# EasyEDA schematic SCH_mini_attiny_2026-08-26.json
TITLE: Sheet_1; REV: 1.0; Date: 2026-08-21; Sheet: 1/1; Drawn By: patriq128; Company: Your Company
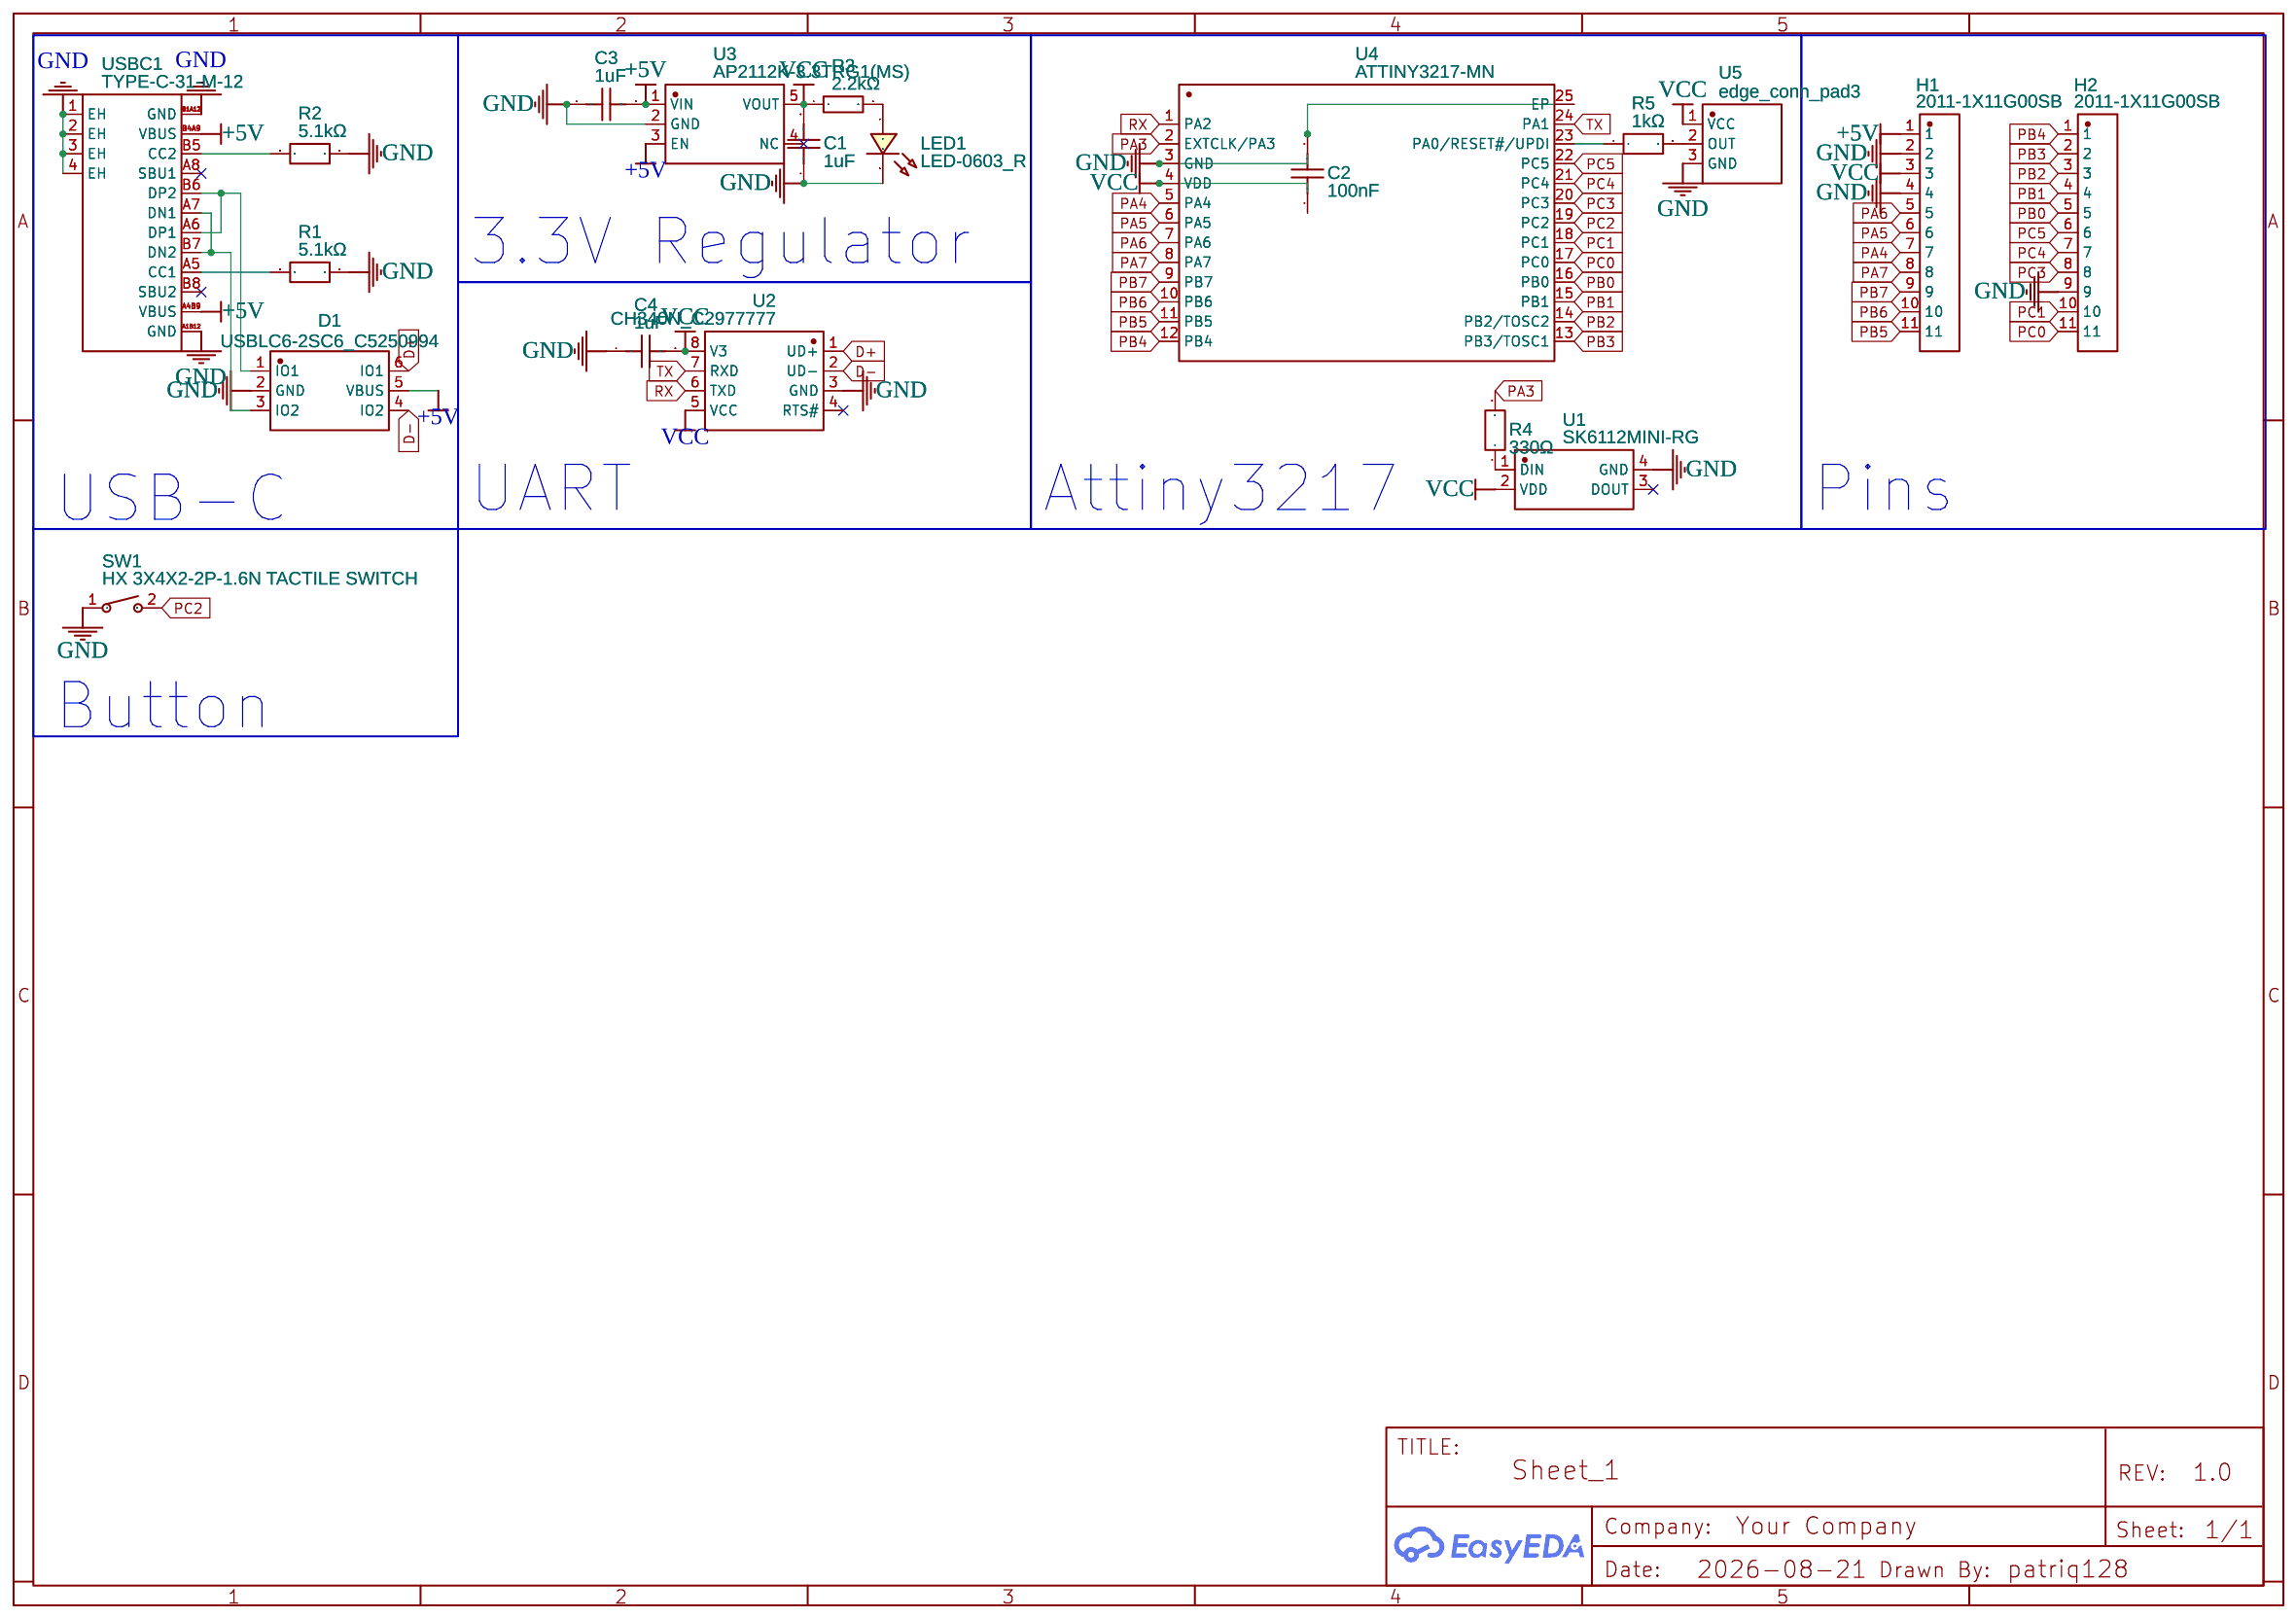
[diagram p0: schematic sheet]

## Parts
C1  1uF  [C0603]
C2  100nF  [C0603]
C3  1uF  [C0603]
C4  1uF  [C0603]
D1  USBLC6-2SC6_C5250994  [SOT-23-6_L2.9-W1.6-P0.95-LS2.8-BL]
H1  2011-1X11G00SB  [HDR-TH_11P-P2.54_2011-1X11G00SB]
H2  2011-1X11G00SB  [HDR-TH_11P-P2.54_2011-1X11G00SB]
LED1  LED-0603_R  [LED0603_RED]
R1  5.1kΩ  [R0603]
R2  5.1kΩ  [R0603]
R3  2.2kΩ  [R0603]
R4  330Ω  [R0603]
R5  1kΩ  [R0603]
SW1  HX 3X4X2-2P-1.6N TACTILE SWITCH  [KEY-SMD_L4.0-W3.0-LS4.9-1]
U1  SK6112MINI-RG  [LED-SMD_4P-L3.7-W3.5-SK6812SMINI-001]
U2  CH340N_C2977777  [SOP-8_L4.9-W3.9-P1.27-LS6.0-BL]
U3  AP2112K-3.3TRG1(MS)  [SOT-23-5_L2.9-W1.6-P0.95-LS2.7-BR]
U4  ATTINY3217-MN  [HVQFN-24_L4.0-W4.0-P0.50-BL-EP2.6]
U5  edge_conn_pad3  [PADPAD4X1.5 3PAD_SIGNALS]
USBC1  TYPE-C-31-M-12  [USB-C_SMD-TYPE-C-31-M-12_1]

## Library data of the parts
C1 C3 C4 = 06033D105MAT2A: Contributor: LCSC; Supplier: LCSC; Supplier Part: C597124; Manufacturer: Kyocera AVX; JLCPCB Part Class: Extended Part
C2 = 06033C104K4T2A: Contributor: LCSC; Supplier: LCSC; Supplier Part: C597114; Manufacturer: Kyocera AVX; JLCPCB Part Class: Extended Part
D1 = USBLC6-2SC6_C5250994: Supplier: LCSC; Supplier Part: C5250994; Manufacturer: TWGMC(迪嘉); Manufacturer Part: USBLC6-2SC6; JLCPCB Part Class: Extended Part; Contributor: lcsc
H1 H2 = 2011-1X11G00SB: Supplier: LCSC; Supplier Part: C49569634; Manufacturer: WingTAT(格林柏); JLCPCB Part Class: Extended Part; Contributor: lcsc
LED1 = LED-0603_R: Manufacturer: EVERLIGHT(台湾亿光); Manufacturer Part: 19-217/R6C-AL1M2VY/3T; Supplier Part: C72044; Supplier: LCSC; Contributor: LCEDA_01
R1 R2 = HOAR0603-1/10W-5.1KR-0.1%-TCR25: Supplier: LCSC; Supplier Part: C5123587; Manufacturer: Milliohm(毫欧); Manufacturer Part: HoAR0603-1/10W-5.1KR-0.1%-TCR25; JLCPCB Part Class: Extended Part; Contributor: lcsc
R3 = RMC06032.2K1%N: Contributor: LCSC; Supplier: LCSC; Supplier Part: C325591; Manufacturer: Tyohm(幸亚电阻); JLCPCB Part Class: Extended Part
R4 = 0603WAD3300T5E: Contributor: LCSC; Supplier: LCSC; Supplier Part: C407595; Manufacturer: UNI-ROYAL(厚声); JLCPCB Part Class: Extended Part
R5 = RMC 0603 1K J N: Supplier: LCSC; Supplier Part: C5362357; Manufacturer: Tyohm(幸亚电阻); JLCPCB Part Class: Extended Part; Contributor: lcsc
SW1 = HX 3X4X2-2P-1.6N TACTILE SWITCH: Supplier: LCSC; Supplier Part: C49234124; Manufacturer: hanxia(韩下); Manufacturer Part: HX 3x4x2-2P-1.6N TACTILE SWITCH; JLCPCB Part Class: Extended Part; Contributor: lcsc
U1 = SK6112MINI-RG: Supplier: LCSC; Supplier Part: C5440781; Manufacturer: 欧思科光电; JLCPCB Part Class: Extended Part; Contributor: lcsc
U2 = CH340N_C2977777: Contributor: LCSC; Supplier: LCSC; Supplier Part: C2977777; Manufacturer: WCH(南京沁恒); Manufacturer Part: CH340N; JLCPCB Part Class: Extended Part
U3 = AP2112K-3.3TRG1(MS): Supplier: LCSC; Supplier Part: C22365427; Manufacturer: MSKSEMI(美森科); JLCPCB Part Class: Extended Part; Contributor: lcsc
U4 = ATTINY3217-MN: Contributor: LCSC; Supplier: LCSC; Supplier Part: C1340454; Manufacturer: MICROCHIP(美国微芯); JLCPCB Part Class: Extended Part
U5 = edge_conn_pad3: Contributor: cozy2jun52
USBC1 = TYPE-C-31-M-12: Contributor: LCSC; Supplier: LCSC; Supplier Part: C165948; Manufacturer: 韩国韩荣; JLCPCB Part Class: Extended Part

## Nets
+5V: C3.2 D1.5(VBUS) H1.1 U3.1(VIN) U3.3(EN) USBC1.A4B9(VBUS) USBC1.B4A9(VBUS)
GND: C1.1 C2.2 C3.1 C4.1 D1.2(GND) H1.2 H1.4 H2.9 LED1.2 R1.1 R2.1 SW1.1 U1.4(GND) U2.3(GND) U3.2(GND) U4.3(GND) U4.25(EP) U5.3(GND) USBC1.1(EH) USBC1.2(EH) USBC1.3(EH) USBC1.4(EH) USBC1.A1B12(GND) USBC1.B1A12(GND)
VCC: C1.2 C2.1 C4.2 H1.3 R3.1 U1.2(VDD) U2.5(VCC) U2.8(V3) U3.5(VOUT) U4.4(VDD) U5.1(VCC)
D+: D1.6(IO1) U2.1(UD+)
D-: D1.4(IO2) U2.2(UD-)
PA3: R4.2 U4.2(EXTCLK/PA3)
PA4: H1.7 U4.5(PA4)
PA5: H1.6 U4.6(PA5)
PA6: H1.5 U4.7(PA6)
PA7: H1.8 U4.8(PA7)
PB0: H2.5 U4.16(PB0)
PB1: H2.4 U4.15(PB1)
PB2: H2.3 U4.14(PB2/TOSC2)
PB3: H2.2 U4.13(PB3/TOSC1)
PB4: H2.1 U4.12(PB4)
PB5: H1.11 U4.11(PB5)
PB6: H1.10 U4.10(PB6)
PB7: H1.9 U4.9(PB7)
PC0: H2.11 U4.17(PC0)
PC1: H2.10 U4.18(PC1)
PC2: SW1.2 U4.19(PC2)
PC3: H2.8 U4.20(PC3)
PC4: H2.7 U4.21(PC4)
PC5: H2.6 U4.22(PC5)
RX: U2.6(TXD) U4.1(PA2)
TX: U2.7(RXD) U4.24(PA1)
Net-(D1-1): D1.1(IO1) USBC1.A6(DP1) USBC1.B6(DP2)
Net-(D1-3): D1.3(IO2) USBC1.A7(DN1) USBC1.B7(DN2)
Net-(LED1-1): LED1.1 R3.2
Net-(R1-2): R1.2 USBC1.A5(CC1)
Net-(R2-2): R2.2 USBC1.B5(CC2)
Net-(R4-1): R4.1 U1.1(DIN)
Net-(R5-1): R5.1 U4.23(PA0/RESET#/UPDI)
Net-(R5-2): R5.2 U5.2(OUT)

Not connected (* = marked no-connect by the designer): U1 3(DOUT)*; U2 4(RTS#)*; U3 4(NC)*; USBC1 A8(SBU1)* B8(SBU2)*

## Notes on the sheet
- 3.3V Regulator
- UART
- Attiny3217
- Pins
- USB-C
- Button
